# EAGLE design badge (EAGLE 7.2.0)
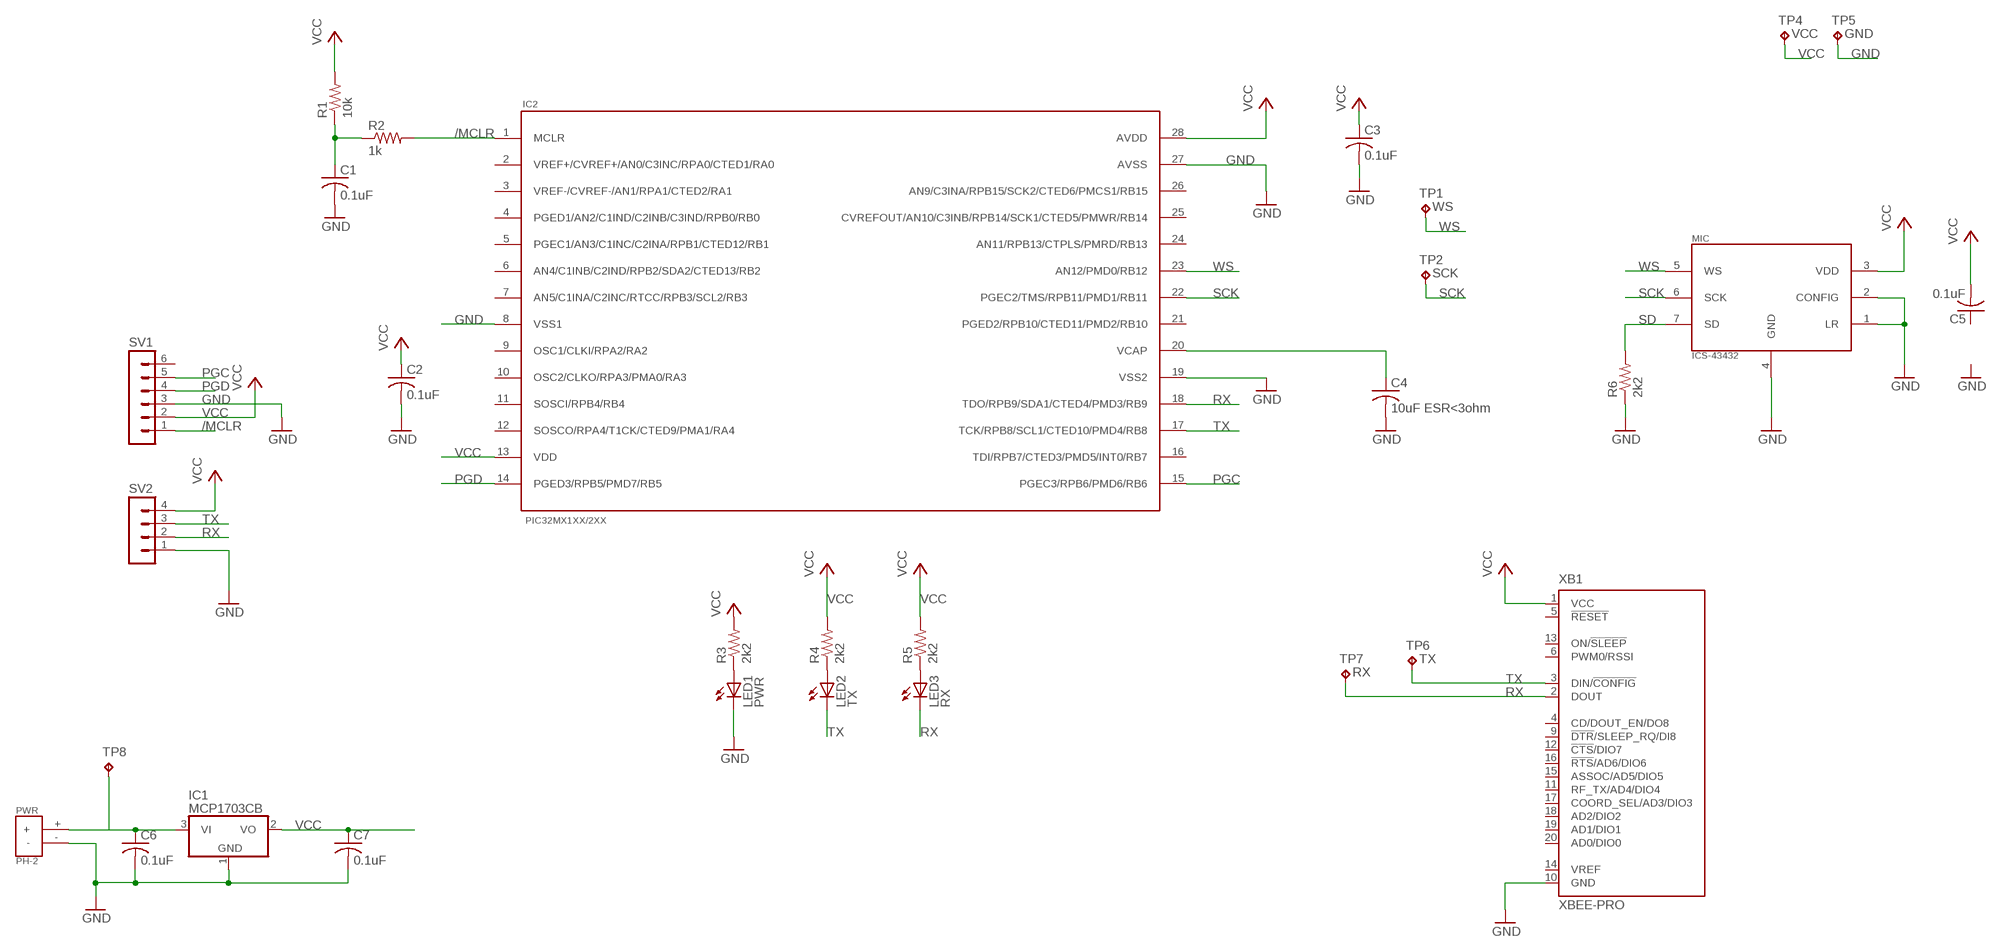
[diagram p0: schematic, sheet 1]

## Parts
C1  0.1uF  C-USC0603  [C0603]
C2  0.1uF  C-USC0603  [C0603]
C3  0.1uF  C-USC0603  [C0603]
C4  10uF ESR<3ohm  C-USC0603  [C0603]
C5  0.1uF  C-USC0603  [C0603]
C6  0.1uF  C-USC0603  [C0603]
C7  0.1uF  C-USC0603  [C0603]
IC1  MCP1703CB  [SOT23]
IC2  PIC32MX1XX/2XX  [SOIC-28]
LED1  PWR  LEDCHIP-LED0603  [CHIP-LED0603]
LED2  TX  LEDCHIP-LED0603  [CHIP-LED0603]
LED3  RX  LEDCHIP-LED0603  [CHIP-LED0603]
MIC  ICS-43432  [ICS-43432]
PWR  PH-2  [PH-2]
R1  10k  R-US_R0603  [R0603]
R2  1k  R-US_R0603  [R0603]
R3  2k2  R-US_R0603  [R0603]
R4  2k2  R-US_R0603  [R0603]
R5  2k2  R-US_R0603  [R0603]
R6  2k2  R-US_R0603  [R0603]
SV1  MA06-1  [MA06-1]
SV2  MA04-1  [MA04-1]
TP1  TPPAD1-13  [P1-13]
TP2  TPPAD1-13  [P1-13]
TP4  TPPAD1-13  [P1-13]
TP5  TPPAD1-13  [P1-13]
TP6  TPPAD1-13  [P1-13]
TP7  TPPAD1-13  [P1-13]
TP8  TPPAD1-13  [P1-13]
XB1  XBEE-PRO  [XBEE-PRO]

## Nets
/MCLR: IC2.1(MCLR) R2.2 SV1.1
GND: C1.2 C2.2 C3.2 C4.2 C6.2 C7.2 IC1.1(GND) IC2.8(VSS1) IC2.19(VSS2) IC2.27(AVSS) LED1.C MIC.1(LR) MIC.2(CONFIG) MIC.4(GND) PWR.- R6.1 SV1.3 SV2.1 TP5.TP XB1.10(GND)
N$1: C1.1 R1.1 R2.1
N$2: C4.1 IC2.20(VCAP)
N$3: LED1.A R3.1
N$4: LED2.A R4.1
N$5: LED3.A R5.1
N$6: C6.1 IC1.3(VI) PWR.+ TP8.TP
PGC: IC2.15(PGEC3/RPB6/PMD6/RB6) SV1.5
PGD: IC2.14(PGED3/RPB5/PMD7/RB5) SV1.4
RX: IC2.18(TDO/RPB9/SDA1/CTED4/PMD3/RB9) LED3.C SV2.2 TP7.TP XB1.2(DOUT)
SCK: IC2.22(PGEC2/TMS/RPB11/PMD1/RB11) MIC.6(SCK) TP2.TP
SD: MIC.7(SD) R6.2
TX: IC2.17(TCK/RPB8/SCL1/CTED10/PMD4/RB8) LED2.C SV2.3 TP6.TP XB1.3(DIN/!CONFIG)
VCC: C2.1 C3.1 C5.2 C7.1 IC1.2(VO) IC2.13(VDD) IC2.28(AVDD) MIC.3(VDD) R1.2 R3.2 R4.2 R5.2 SV1.2 SV2.4 TP4.TP XB1.1(VCC)
WS: IC2.23(AN12/PMD0/RB12) MIC.5(WS) TP1.TP
Unconnected: C5.1 IC2.2(VREF+/CVREF+/AN0/C3INC/RPA0/CTED1/RA0) IC2.3(VREF-/CVREF-/AN1/RPA1/CTED2/RA1) IC2.4(PGED1/AN2/C1IND/C2INB/C3IND/RPB0/RB0) IC2.5(PGEC1/AN3/C1INC/C2INA/RPB1/CTED12/RB1) IC2.6(AN4/C1INB/C2IND/RPB2/SDA2/CTED13/RB2) IC2.7(AN5/C1INA/C2INC/RTCC/RPB3/SCL2/RB3) IC2.9(OSC1/CLKI/RPA2/RA2) IC2.10(OSC2/CLKO/RPA3/PMA0/RA3) IC2.11(SOSCI/RPB4/RB4) IC2.12(SOSCO/RPA4/T1CK/CTED9/PMA1/RA4) IC2.16(TDI/RPB7/CTED3/PMD5/INT0/RB7) IC2.21(PGED2/RPB10/CTED11/PMD2/RB10) IC2.24(AN11/RPB13/CTPLS/PMRD/RB13) IC2.25(CVREFOUT/AN10/C3INB/RPB14/SCK1/CTED5/PMWR/RB14) IC2.26(AN9/C3INA/RPB15/SCK2/CTED6/PMCS1/RB15) SV1.6 XB1.4(CD/DOUT_EN/DO8) XB1.5(!RESET) XB1.6(PWM0/RSSI) XB1.9(!DTR!/SLEEP_RQ/DI8) XB1.11(RF_TX/AD4/DIO4) XB1.12(!CTS!/DIO7) XB1.13(ON/!SLEEP) XB1.14(VREF) XB1.15(ASSOC/AD5/DIO5) XB1.16(!RTS!/AD6/DIO6) XB1.17(COORD_SEL/AD3/DIO3) XB1.18(AD2/DIO2) XB1.19(AD1/DIO1) XB1.20(AD0/DIO0)

## Library data of the parts
C1-C7 = resistor:C-US: CAPACITOR, American symbol
IC1 = linear:MCP1703: 250 mA, 16V, Low Quiescent Current LDO Regulator Source: http://ww1.microchip.com/downloads/en/DeviceDoc/22049b.pdf
IC2 = mic:PIC32MX1XX/2XX
LED1-LED3 = led:LED: LED OSRAM: - CHIPLED LG R971, LG N971, LY N971, LG Q971, LY Q971, LO R971, LY R971 LH N974, LH R974 LS Q976, LO Q976, LY Q976 LO Q996 - Hyper CHIPLED LW Q18S LB Q993, LB Q99A, LB R99A - SideLED LS A670, LO A670, LY A670, LG A670, LP A670 LB A673, LV A673, LT A673, LW A673 LH A674 LY A675 LS A676, LA A676, LO A676, LY A676, LW A676 LS A679, LY A679, LG A679 - Hyper Micro SIDELED® LS Y876, LA Y876, LO Y876, LY Y876 LT Y87S - SmartLED LW L88C, LW L88S LB L89C, LB L89S, LG L890 LS L89K, LO L89K, LY L89K LS L896, LA L896, LO L896, LY L896 - TOPLED LS T670, LO T670, LY T670, LG T670, LP T670 LSG T670, LSP T670, LSY T670, LOP T670, LYG T670 LG T671, LOG T671, LSG T671 LB T673, LV T673, LT T673, LW T673 LH T674 LS T676, LA T676, LO T676, LY T676, LB T676, LH T676, LSB T676, LW T676 LB T67C, LV T67C, LT T67C, LS T67K, LO T67K, LY T67K, LW E67C LS E67B, LA E67B, LO E67B, LY E67B, LB E67C, LV E67C, LT E67C LW T67C LS T679, LY T679, LG T679 LS T770, LO T770, LY T770, LG T770, LP T770 LB T773, LV T773, LT T773, LW T773 LH T774 LS E675, LA E675, LY E675, LS T675 LS T776, LA T776, LO T776, LY T776, LB T776 LHGB T686 LT T68C, LB T68C - Hyper Mini TOPLED® LB M676 - Mini TOPLED Santana® LG M470 LS M47K, LO M47K, LY M47K Source: http://www.osram.convergy.de LUXEON: - LUMILED® LXK2-PW12-R00, LXK2-PW12-S00, LXK2-PW14-U00, LXK2-PW14-V00 LXK2-PM12-R00, LXK2-PM12-S00, LXK2-PM14-U00 LXK2-PE12-Q00, LXK2-PE12-R00, LXK2-PE12-S00, LXK2-PE14-T00, LXK2-PE14-U00 LXK2-PB12-K00, LXK2-PB12-L00, LXK2-PB12-M00, LXK2-PB14-N00, LXK2-PB14-P00, LXK2-PB14-Q00 LXK2-PR12-L00, LXK2-PR12-M00, LXK2-PR14-Q00, LXK2-PR14-R00 LXK2-PD12-Q00, LXK2-PD12-R00, LXK2-PD12-S00 LXK2-PH12-R00, LXK2-PH12-S00 LXK2-PL12-P00, LXK2-PL12-Q00, LXK2-PL12-R00 Source: www.luxeon.com KINGBRIGHT: KA-3528ASYC Source: www.kingbright.com
MIC = mic:ICS-43432
PWR = mic:PH-2
R1-R6 = resistor:R-US_: RESISTOR, American symbol
SV1 = con-lstb:MA06-1: PIN HEADER; OC_FARNELL: unknown; OC_NEWARK: unknown
SV2 = con-lstb:MA04-1: PIN HEADER; OC_FARNELL: unknown; OC_NEWARK: unknown
TP1 = testpad:TP: Test pad; TP_SIGNAL_NAME: WS
TP2 = testpad:TP: Test pad; TP_SIGNAL_NAME: SCK
TP4 = testpad:TP: Test pad; TP_SIGNAL_NAME: VCC
TP5 = testpad:TP: Test pad; TP_SIGNAL_NAME: GND
TP6 = testpad:TP: Test pad; TP_SIGNAL_NAME: TX
TP7 = testpad:TP: Test pad; TP_SIGNAL_NAME: RX
TP8 = testpad:TP: Test pad; TP_SIGNAL_NAME: PWR
XB1 = maxstream:XBEE: XBee (TM) /XBee-PRO(TM) OEM RF Modules Source: MaxStream, Inc. xbee_productmanual.pdf; MPN: XBP24-AWI-001; OC_FARNELL: 1337916; OC_NEWARK: 42M2667

## Board
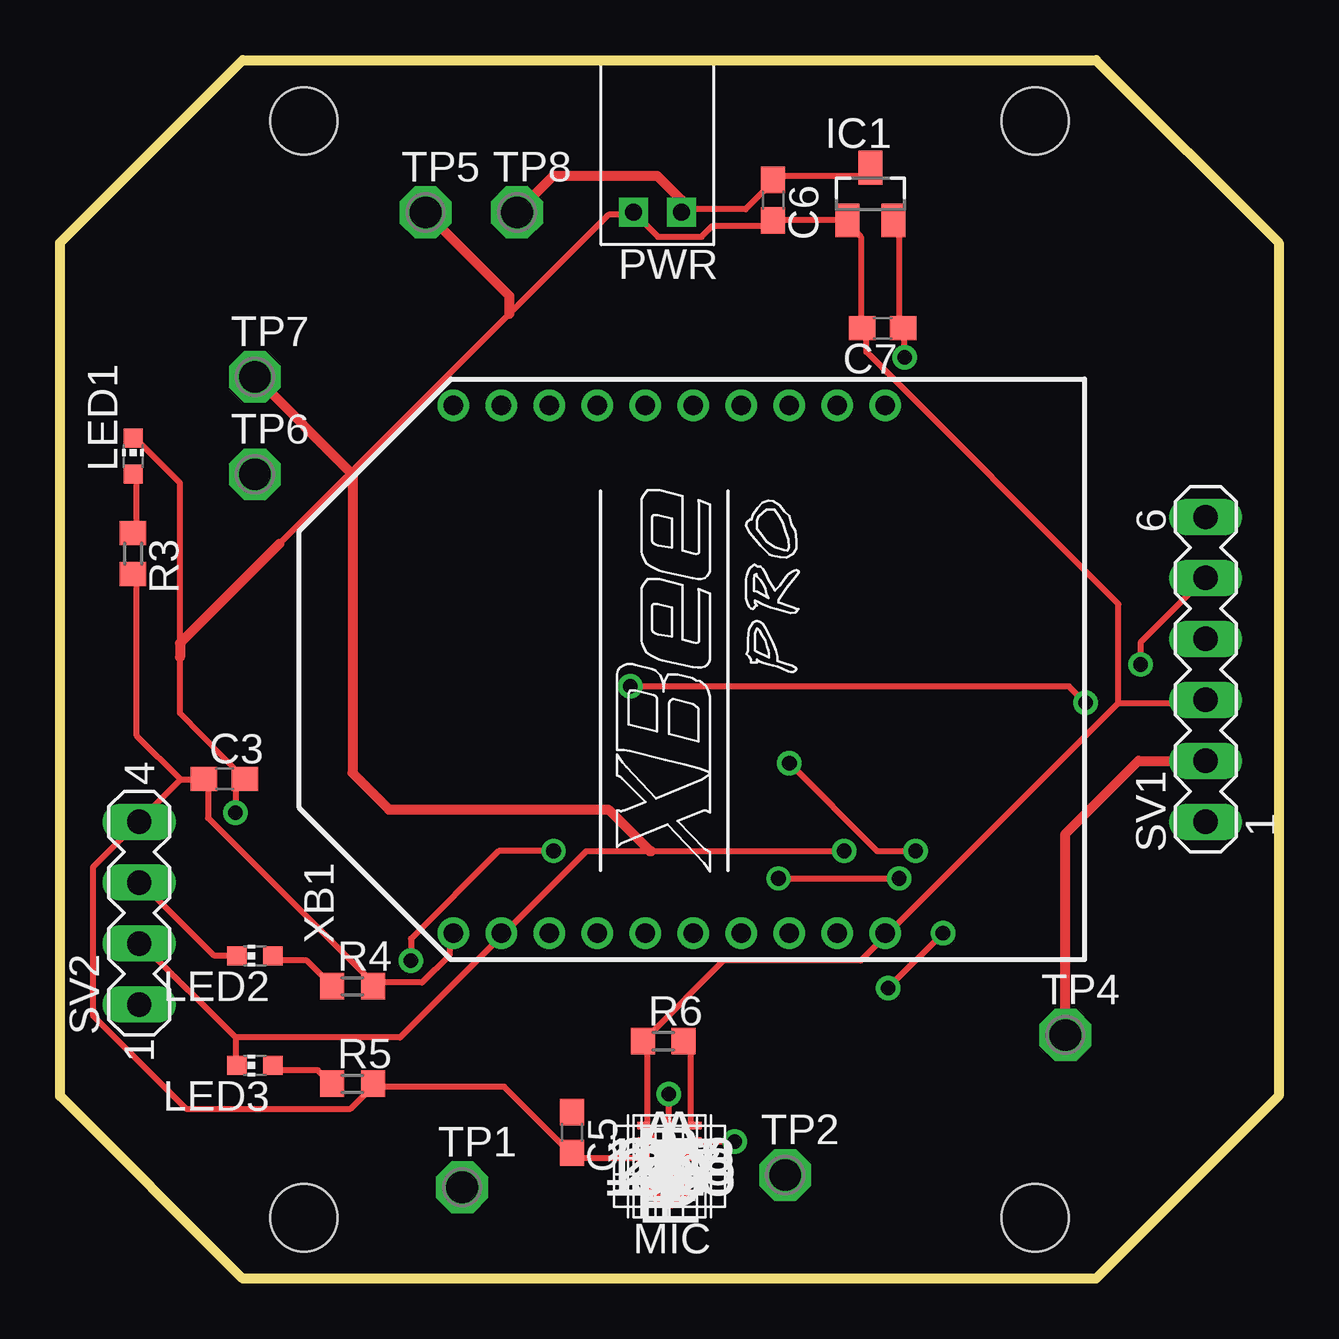
[diagram p1: board, top side]
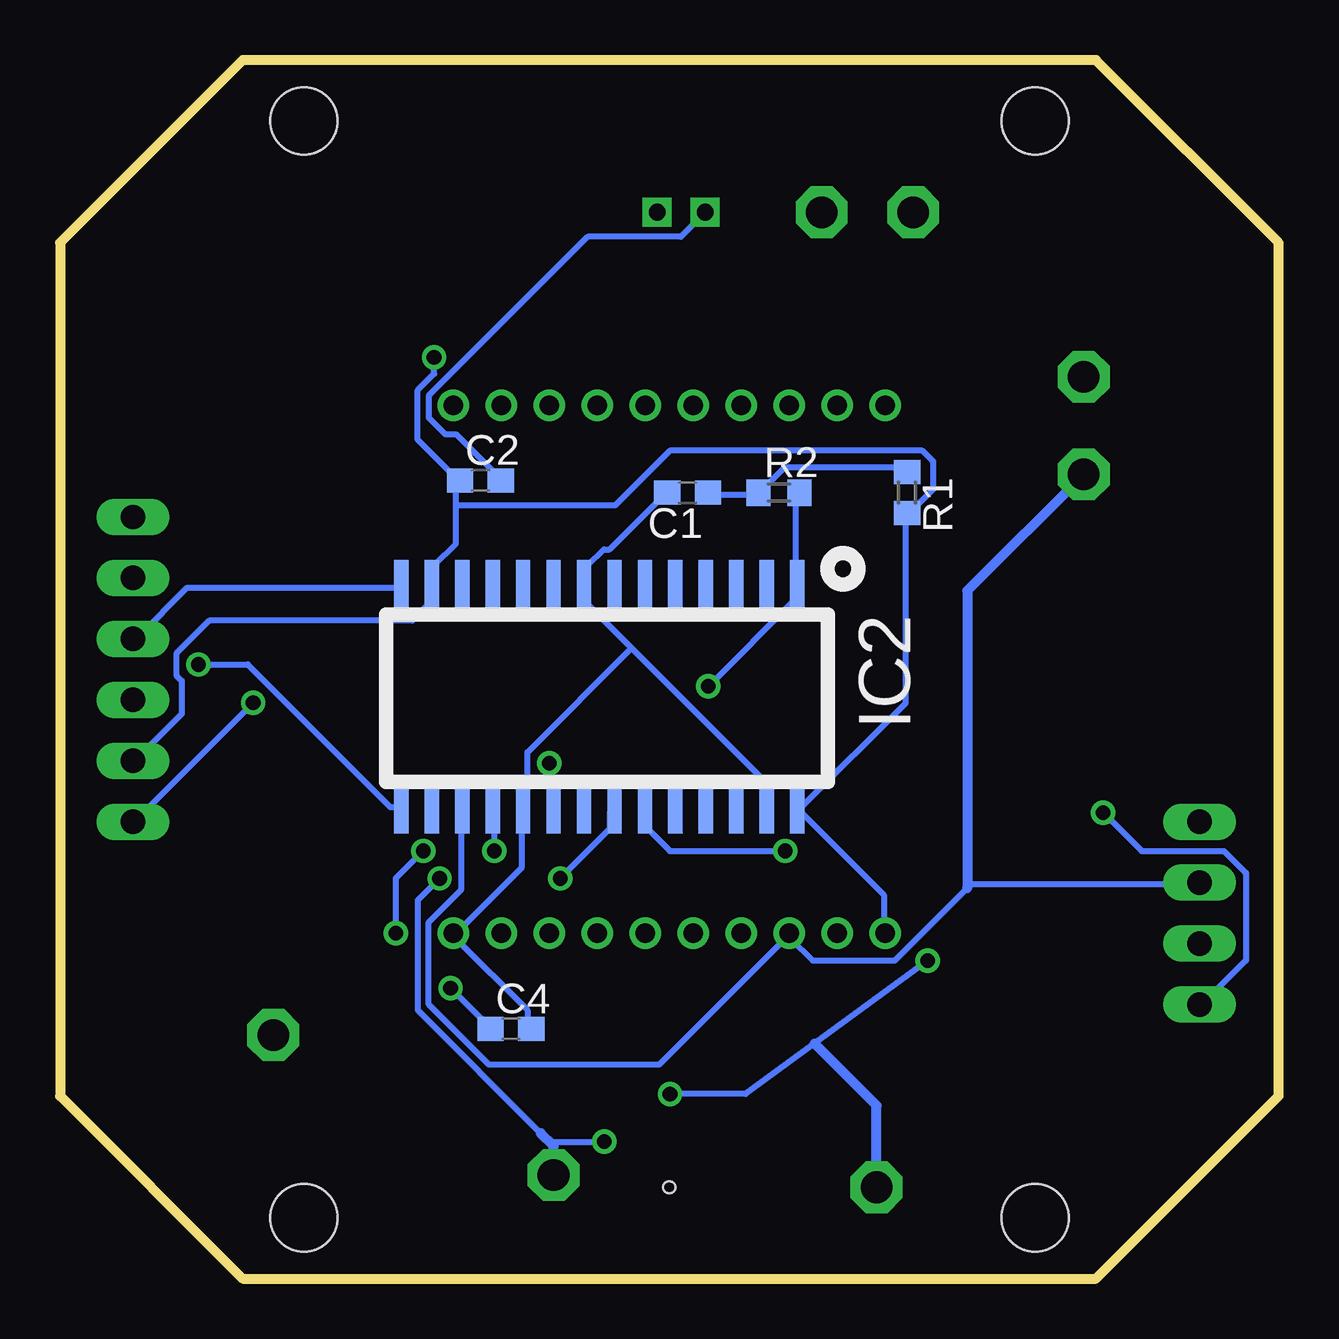
[diagram p2: board, bottom side, seen from below]

Size 50.8 x 50.8 mm. Coordinates in mm from the lower left corner, seen from the top.
Outline: 7.62,0 0,7.62 0,43.18 7.62,50.8 43.18,50.8 50.8,43.18 50.8,7.62 43.18,0 7.62,0
Copper layers (1*16): Top 0.035mm / dielectric 1.5mm / Bottom 0.035mm
Design rules "default": minimum track width 10mil, minimum drill 24mil, track to track 8mil, track to pad 8mil, pad to pad 8mil, via to via 8mil, smd to smd 8mil, copper to edge 40mil, drill to drill 8mil, minimum pad ring 10mil, minimum via ring 8mil, stop-mask expansion 4mil, vias tented up to drill 0mil, thermal gap 10mil
Holes 2.8 mm at 10.16,48.26 10.16,2.54 40.64,2.54 40.64,48.26

### Footprints (pad centres in the part's own frame; a part is rotated, then mirrored left to right if it is on the bottom)
C0603 = smd 1.1 x 1: 1 -0.85,0; 2 0.85,0
SOT23 = smd 1 x 1.4: 1 -0.95,-1.1; 2 0.95,-1.1; 3 0,1.1
SOIC-28 = smd 2 x 0.6: 1 0,0; 2 0,-1.27; 3 0,-2.54; 4 0,-3.81; 5 0,-5.08; 6 0,-6.35; 7 0,-7.62; 8 0,-8.89; 9 0,-10.16; 10 0,-11.43; 11 0,-12.7; 12 0,-13.97; 13 0,-15.24; 14 0,-16.51; 15 9.4,-16.51; 16 9.4,-15.24; 17 9.4,-13.97; 18 9.4,-12.7; 19 9.4,-11.43; 20 9.4,-10.16; 21 9.4,-8.89; 22 9.4,-7.62; 23 9.4,-6.35; 24 9.4,-5.08; 25 9.4,-3.81; 26 9.4,-2.54; 27 9.4,-1.27; 28 9.4,0
CHIP-LED0603 = smd 0.8 x 0.8: A 0,-0.75; C 0,0.75
ICS-43432 = smd 0.5 x 0.3: 1 1.08,-2.575; 2 1.08,-1.925; 3 1.08,-1.275; 5 -1.08,-1.275; 6 -1.08,-1.925; 7 -1.08,-2.575 | smd 0.3 x 0.5: 4 0.75,0 | hole 0.5: 0,0
PH-2 = drill 0.7 square: + 0,0; - 2,0
R0603 = smd 1 x 1.1: 1 -0.85,0; 2 0.85,0
MA06-1 = drill 1.016 long: 1 -6.35,0; 2 -3.81,0; 3 -1.27,0; 4 1.27,0; 5 3.81,0; 6 6.35,0
MA04-1 = drill 1.016 long: 1 -3.81,0; 2 -1.27,0; 3 1.27,0; 4 3.81,0
P1-13 = drill 1.321 pad 2.159 octagon: TP 0,0
XBEE-PRO = drill 0.8 pad 1.27: 1 -11,9; 2 -11,7; 3 -11,5; 4 -11,3; 5 -11,1; 6 -11,-1; 7 -11,-3; 8 -11,-5; 9 -11,-7; 10 -11,-9; 11 11,-9; 12 11,-7; 13 11,-5; 14 11,-3; 15 11,-1; 16 11,1; 17 11,3; 18 11,5; 19 11,7; 20 11,9

### Placement (x,y rotation side)
C1  24.64,32.77 180 bottom
C2  33.27,33.27 0 bottom
C3  6.86,20.83 0 top
C4  32,10.41 0 bottom
C5  21.34,6.1 270 top
C6  29.72,44.96 270 top
C7  34.29,39.62 180 top
IC1  33.78,45.21 0 top
IC2  20.07,28.96 270 bottom
LED1  3.05,34.29 0 top
LED2  8.13,13.46 90 top
LED3  8.13,8.89 90 top
MIC  25.4,3.81 180 top
PWR  25.91,44.45 180 top
R1  15.49,32.77 270 bottom
R2  20.83,32.77 0 bottom
R3  3.05,30.23 270 top
R4  12.19,12.19 0 top
R5  12.19,8.13 0 top
R6  25.15,9.91 0 top
SV1  47.75,25.4 90 top
SV2  3.3,15.24 90 top
TP1  16.76,3.81 0 top
TP2  30.23,4.32 0 top
TP4  41.91,10.16 0 top
TP5  15.24,44.45 0 top
TP6  8.13,33.53 0 top
TP7  8.13,37.59 0 top
TP8  19.05,44.45 0 top
XB1  25.4,25.4 90 top

### Tracks (layer width: path | path; a pad name or v marks a point on that pad's centre or on a via)
/MCLR  (via drill 0.61)
  Top 0.254: v23.77,24.69 42.06,24.69 v42.75,24
  Bottom 0.254: R2.2 20.12,32.69 20.12,29.03 IC2.1 20.12,28.8 20.12,28.35 v23.77,24.69 | v42.75,24 47.55,19.2 SV1.1
GND  (via drill 0.61)
  Top 0.254: LED1.C 3.2,34.98 5,33.17 5,25.91 5,23.57 C3.2 7.54,20.8 7.32,20.57 v7.32,19.43 | 24.46,6.4 24.71,5.71 MIC.2 | 24.46,6.4 24.46,9.83 R6.1 24.46,10.06 27.66,13.26 33.38,13.26 34.29,14.17 XB1.10 34.52,14.4 44.12,24 | 24.46,6.4 MIC.1 | 44.12,24 47.55,24 SV1.3 | 44.12,24 44.12,28.12 33.6,38.63 33.6,39.55 C7.2 33.38,39.78 33.38,43.43 32.92,43.89 IC1.1 32.69,44.12 C6.2 29.72,43.89 27.2,43.89 26.75,43.43 24.92,43.43 24,44.35 PWR.- 23.77,44.35 22.86,44.35 18.72,40.21 9.14,30.63
  Top 0.305: 24.71,5.71 25.4,5.08 25.15,4.57 MIC.4
  Top 0.406: TP5.TP 18.72,40.97 18.72,40.21 | 9.14,30.63 5,26.49 5,25.91
  Bottom 0.254: v7.32,19.43 5.71,17.83 2.29,17.83 1.37,16.92 1.37,13.26 3.2,11.43 SV2.1 | C2.2 32.46,33.38 34.29,35.2 34.75,35.2 35.43,35.89 35.43,36.8 28.8,43.43 24.92,43.43 24,44.35 PWR.- | C1.2 25.6,32.69 27.89,30.4 28.12,30.4 28.8,29.72 28.8,29.03 IC2.8 28.8,28.8 28.8,28.12 26.98,26.29 | 26.98,26.29 21.49,20.8 21.49,19.66 IC2.27 | C4.2 31.32,10.52 31.32,11.2 34.29,14.17 XB1.10 34.29,14.4 31.55,17.14 31.55,19.43 IC2.19 31.32,19.66 31.32,21.95 26.98,26.29
N$1
  Bottom 0.254: C1.1 23.77,32.69 21.72,32.69 R2.1 21.49,32.92 20.57,33.83 15.54,33.83 R1.1
N$2  (via drill 0.61)
  Top 0.254: v36.8,14.4 v34.52,12.12 | v35.66,17.83 34.06,17.83 v30.4,21.49
  Bottom 0.254: v34.52,12.12 32.92,10.52 C4.1 | v36.8,14.4 36.8,16.69 v35.66,17.83 | v30.4,21.49 30.4,19.66 IC2.20
N$3
  Top 0.254: LED1.A 3.2,33.38 3.2,31.09 R3.1
N$4
  Top 0.254: LED2.A 8.91,13.26 10.29,13.26 11.2,12.34 R4.1
N$5
  Top 0.254: LED3.A 8.91,8.69 10.74,8.69 11.2,8.23 R5.1
N$6
  Top 0.254: IC1.3 33.6,46.18 33.38,45.95 29.72,45.95 C6.1 29.72,45.72 28.57,44.58 26.06,44.58 PWR.+
  Top 0.406: TP8.TP 20.57,45.97 24.89,45.97 25.91,44.96 PWR.+
PGC  (via drill 0.61)
  Top 0.254: v45.03,25.6 45.03,26.52 47.55,29.03 SV1.5
  Bottom 0.254: v45.03,25.6 42.98,25.6 37.03,19.66 36.58,19.66 IC2.15
PGD
  Bottom 0.254: IC2.14 36.58,28.8 45.49,28.8 47.55,26.75 SV1.4
RX  (via drill 0.61)
  Top 0.254: 7.32,10.06 7.32,8.91 LED3.C | 7.32,10.06 3.43,13.95 SV2.2 | v32.69,17.83 24.64,17.83 21.95,17.83 18.52,14.4 XB1.2 18.29,14.17 14.17,10.06 7.32,10.06
  Top 0.406: TP7.TP 12.19,33.53 12.19,21.08 13.72,19.56 22.86,19.56 24.59,17.83 24.64,17.83
  Bottom 0.254: v32.69,17.83 32.69,19.43 IC2.18
SCK  (via drill 0.61)
  Top 0.254: v28.12,5.71 26.52,5.71 MIC.6 | v29.95,16.69 v34.98,16.69
  Bottom 0.254: v28.12,5.71 30.4,5.71 30.76,6.07 35.89,11.2 35.89,15.77 v34.98,16.69 | v29.95,16.69 27.89,18.75 27.89,19.43 IC2.22
  Bottom 0.406: TP2.TP 30.23,5.54 30.76,6.07
SD
  Top 0.254: MIC.7 26.29,6.4 26.29,9.6 26.06,9.83 R6.2
TX
  Top 0.254: LED2.C 7.32,13.49 6.4,13.49 3.43,16.46 SV2.3
  Bottom 0.254: IC2.17 34.06,19.43 34.06,16.23 35.43,14.86 35.43,11.43 32.92,8.91 25.83,8.91 20.57,14.17 XB1.3 20.34,14.17 19.43,13.26 16,13.26 12.98,16.28 12.8,16.46 3.43,16.46 SV2.3
  Bottom 0.406: TP6.TP 12.98,28.68 12.98,16.28
VCC  (via drill 0.61)
  Top 0.254: IC1.2 34.75,43.89 34.98,43.66 34.98,39.78 C7.1 35.2,39.55 v35.2,38.41 | XB1.1 16.23,14.17 16.23,13.49 15.09,12.34 13.26,12.34 R4.2 13.03,12.34 6.17,19.2 6.17,20.8 C3.1 5.94,20.8 5.03,20.8 | MIC.3 24.23,5.03 21.49,5.03 C5.2 21.26,5.26 18.52,8 13.26,8 R5.2 13.03,8 12.12,7.09 5.26,7.09 1.37,10.97 1.37,17.14 3.2,18.97 SV2.4 3.43,19.2 5.03,20.8 | 5.03,20.8 3.2,22.63 3.2,29.26 R3.2
  Top 0.406: TP4.TP 41.91,18.54 44.96,21.59 SV1.2
  Bottom 0.254: 34.29,32.23 34.29,30.63 35.2,29.72 35.2,29.03 IC2.13 35.43,28.8 35.43,28.12 36.12,27.43 44.58,27.43 45.95,26.06 45.95,25.15 45.72,24.92 45.72,23.55 47.55,21.72 SV1.2 | 34.29,32.23 34.29,33.15 C2.1 34.29,33.38 35.89,34.98 35.89,37.03 35.2,37.72 v35.2,38.41 | XB1.1 16.46,14.4 16.46,16 19.89,19.43 IC2.28 19.89,19.66 15.54,24 15.54,31.77 R1.2 15.32,32 14.4,32.92 14.4,34.06 14.86,34.52 25.38,34.52 27.66,32.23 34.29,32.23
WS  (via drill 0.61)
  Top 0.254: v25.38,7.7 25.38,5.94 26.29,5.03 MIC.5 | v14.63,13.26 14.63,14.17 18.29,17.83 v20.57,17.83
  Bottom 0.254: v25.38,7.7 22.23,7.7 19.35,9.8 v14.63,13.26 | v20.57,17.83 25.38,17.83 26.29,18.75 26.29,19.43 IC2.23
  Bottom 0.406: TP1.TP 16.76,7.22 19.35,9.8